# Altium schematic sheet Rocket_Stack_Template_v1.SchDoc
size A4; SheetNumber: 1; SheetTotal: 1
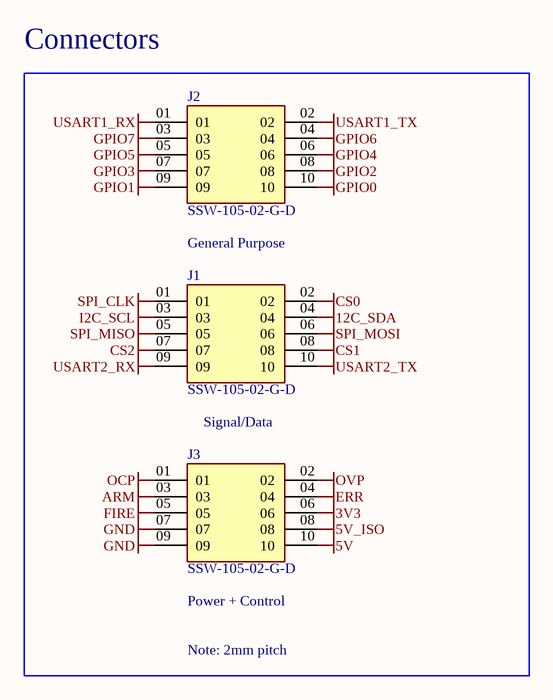
[diagram p0: Rocket_Stack_Template_v1.SchDoc]

## Parts
J1  SSW-105-02-G-D  [SAMTEC_SSW-105-02-G-D]
J2  SSW-105-02-G-D  [SAMTEC_SSW-105-02-G-D]
J3  SSW-105-02-G-D  [SAMTEC_SSW-105-02-G-D]

## Blocks framed on the sheet
Connectors: J1-J3

## Nets
3V3: J3.06
5V: J3.10
5V_ISO: J3.08
12C_SDA: J1.04
ARM: J3.03
CS0: J1.02
CS1: J1.08
CS2: J1.07
ERR: J3.04
FIRE: J3.05
GND: J3.07 J3.09
GPIO0: J2.10
GPIO1: J2.09
GPIO2: J2.08
GPIO3: J2.07
GPIO4: J2.06
GPIO5: J2.05
GPIO6: J2.04
GPIO7: J2.03
I2C_SCL: J1.03
OCP: J3.01
OVP: J3.02
SPI_CLK: J1.01
SPI_MISO: J1.05
SPI_MOSI: J1.06
USART1_RX: J2.01
USART1_TX: J2.02
USART2_RX: J1.09
USART2_TX: J1.10

## Notes on the sheet
- General Purpose
- Signal/Data
- (near J3) Power + Control
- Note: 2mm pitch

## Library data of the parts
J1-J3 = SSW-105-02-G-D: MF: Samtec Inc.; Package: None; Availability: Unavailable; Value: *; MP: SSW-105-02-G-D; Price: None